# EAGLE design led_panel (EAGLE 9.6.2)
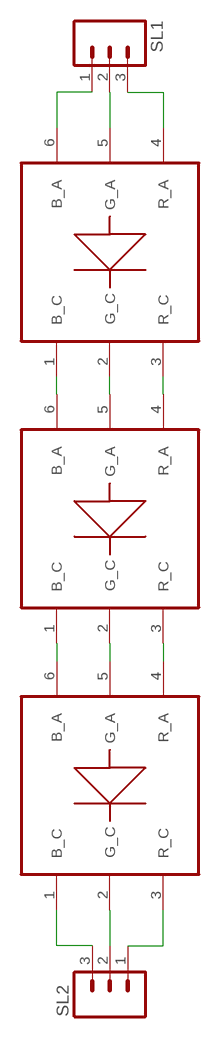
[diagram p0: schematic, sheet 1]

## Parts
SL1  M03  [03P]
SL2  M03  [03P]
U$1  RGB_SMD_3W  [RGB_SMD_6PIN]
U$2  RGB_SMD_3W  [RGB_SMD_6PIN]
U$3  RGB_SMD_3W  [RGB_SMD_6PIN]

## Nets
N$1: SL1.3 U$1.4(R_A)
N$2: SL1.1 U$1.6(B_A)
N$3: SL2.3 U$3.1(B_C)
N$4: SL2.2 U$3.2(G_C)
N$5: SL2.1 U$3.3(R_C)
N$8: U$1.1(B_C) U$2.6(B_A)
N$9: U$1.2(G_C) U$2.5(G_A)
N$10: U$1.3(R_C) U$2.4(R_A)
N$11: U$2.1(B_C) U$3.6(B_A)
N$12: U$2.2(G_C) U$3.5(G_A)
N$15: U$2.3(R_C) U$3.4(R_A)
N$16: SL1.2 U$1.5(G_A)

## Library data of the parts
SL1 SL2 = con-amp-quick:M03: AMP QUICK CONNECTOR; OC_FARNELL: unknown; OC_NEWARK: unknown
U$1-U$3 = CEDT_JANUARY_2015_v6:RGB_SMD_3W: RGB SMD 3W(1W each)

## Board
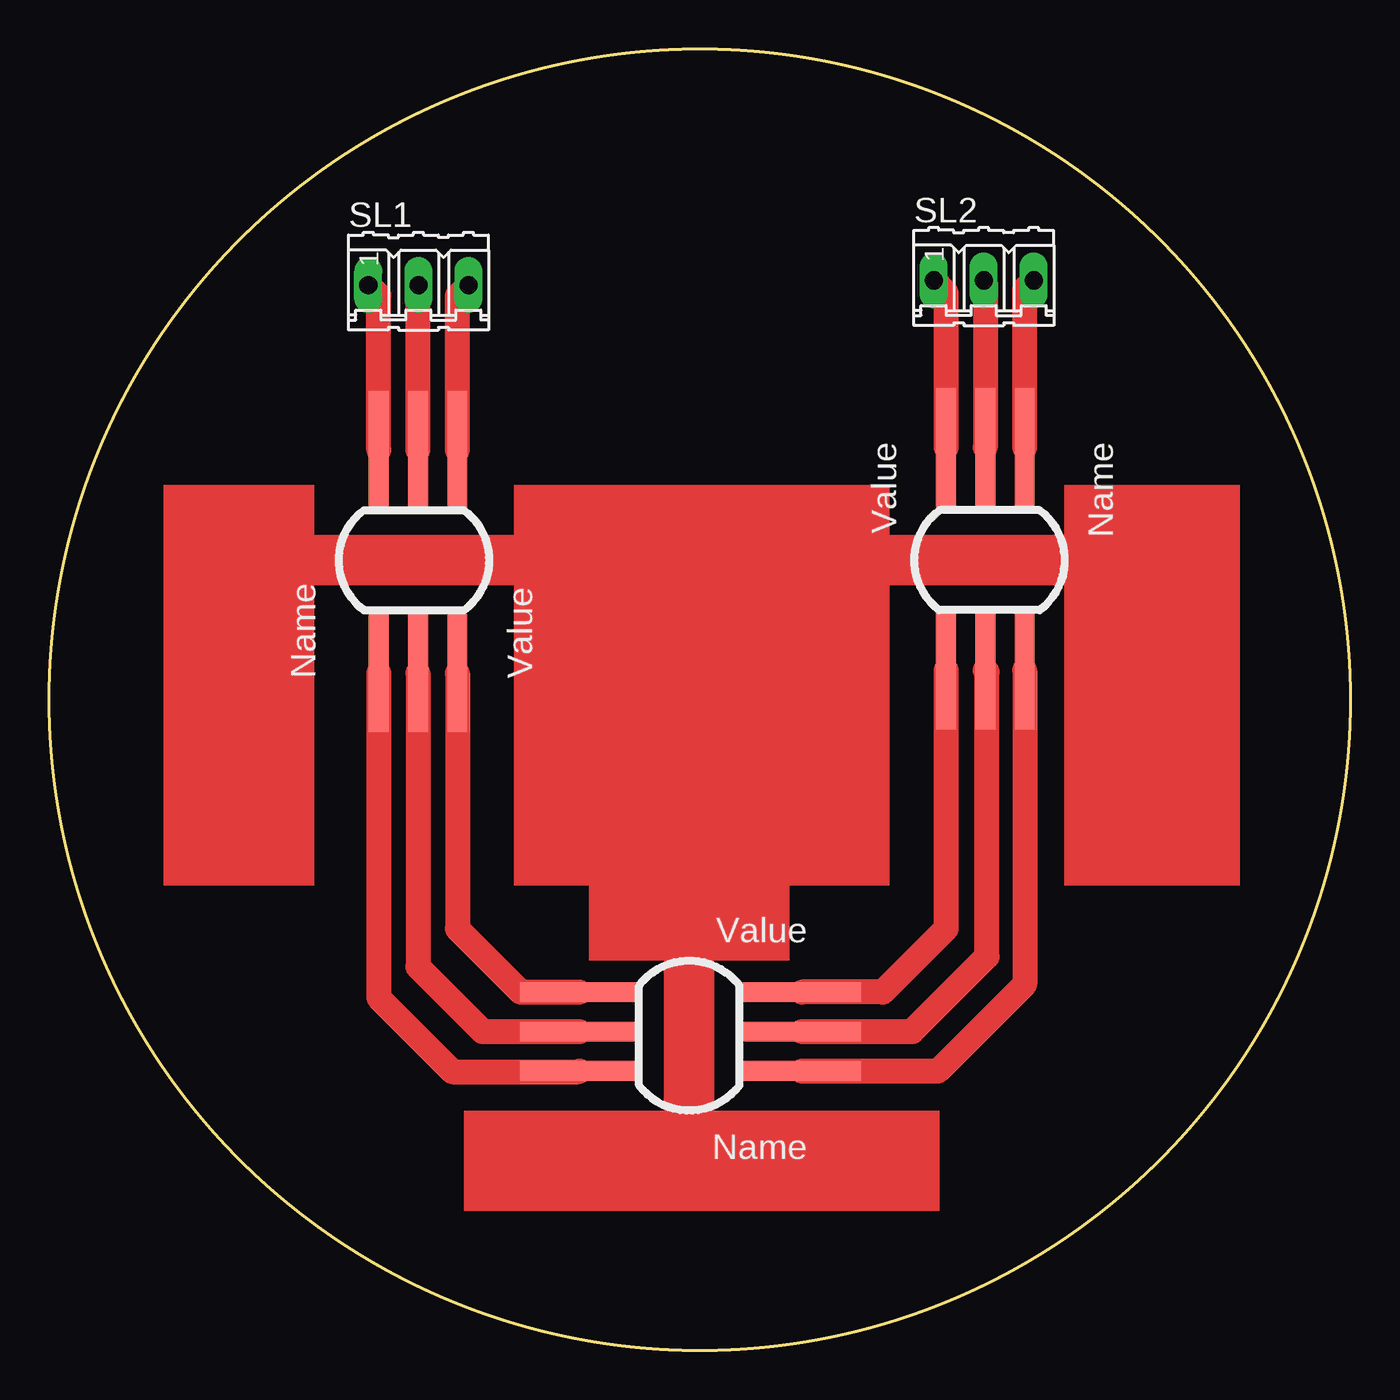
[diagram p1: board, top side]

Size 66.04 x 66.04 mm. Coordinates in mm from the lower left corner, seen from the top.
Outline: circle at 33.02,33.02 radius 33.02
Copper layers (1*16): Top 0.035mm / dielectric 1.5mm / Bottom 0.035mm
Design rules "default": minimum track width 6mil, minimum drill 0.35mm, track to track 6mil, track to pad 6mil, pad to pad 6mil, via to via 6mil, smd to smd 6mil, copper to edge 40mil, drill to drill 6mil, minimum pad ring 10mil, minimum via ring 8mil, stop-mask expansion 4mil, vias tented up to drill 0mil, thermal gap 10mil

### Footprints (pad centres in the part's own frame; a part is rotated, then mirrored left to right if it is on the bottom)
03P = drill 0.914 long: 1 -2.54,0; 2 0,0; 3 2.54,0
RGB_SMD_6PIN = smd 6 x 0.998: 1 -5.728,1.795; 2 -5.728,-0.205; 3 -5.728,-2.205; 4 5.59,-2.205; 5 5.59,-0.205; 6 5.59,1.795

### Placement (x,y rotation side)
SL1  18.74,54.07 0 top
SL2  47.43,54.31 0 top
U$1  18.51,40.1 90 top
U$2  32.48,15.97 180 top
U$3  47.72,40.1 270 top

### Tracks (layer width: path | path; a pad name or v marks a point on that pad's centre or on a via)
N$1
  Top 1.27: U$1.4 20.72,53.52 SL1.3
N$2
  Top 1.27: U$1.6 16.72,53.55 SL1.1
N$3
  Top 1.27: U$3.1 49.52,53.85 SL2.3
N$4
  Top 1.27: SL2.2 47.52,54.22 U$3.2
N$5
  Top 1.27: SL2.1 45.52,53.68 U$3.3
N$8
  Top 1.27: U$1.1 16.72,17.89 20.47,14.14 26.85,14.14 U$2.6
N$9
  Top 1.27: U$2.5 22,16.18 18.72,19.46 U$1.2
N$10
  Top 1.27: U$1.3 20.72,21.39 23.93,18.18 U$2.4
N$11
  Top 1.27: U$3.6 49.52,18.58 45.1,14.16 38.23,14.16 U$2.1
N$12
  Top 1.27: U$2.2 43.8,16.18 47.6,19.98 47.6,34.43 U$3.5
N$15
  Top 1.27: U$3.4 45.52,21.39 42.31,18.18 U$2.3
N$16
  Top 1.27: U$1.5 18.72,54.06 SL1.2
(copper drawn outside any net)
  shapes: Top area x8